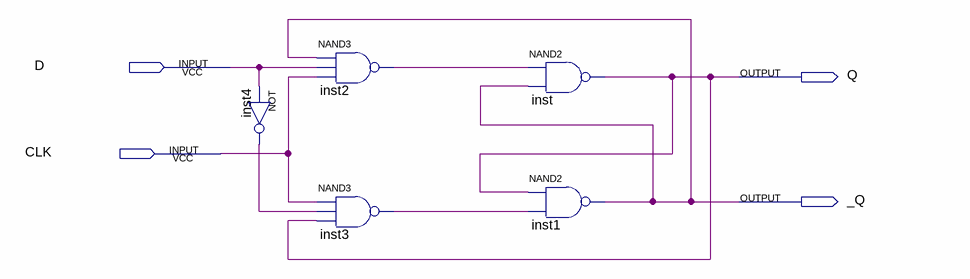
[diagram p0: schematic sheet]
// Quartus schematic ffdclk.bdf as structural Verilog: 5 symbols, 4 pins
module ffdclk (
  input  D,
  input  CLK,
  output Q,
  output _Q
);

  wire inst2_out, inst3_out, inst4_out;

  not inst4 (inst4_out, D);
  nand inst2 (inst2_out, _Q, D, CLK);
  nand inst3 (inst3_out, CLK, inst4_out, Q);
  nand inst (Q, inst2_out, _Q);
  nand inst1 (_Q, Q, inst3_out);
endmodule
